# EAGLE design tda1072-ne612 (EAGLE 7.6.0)
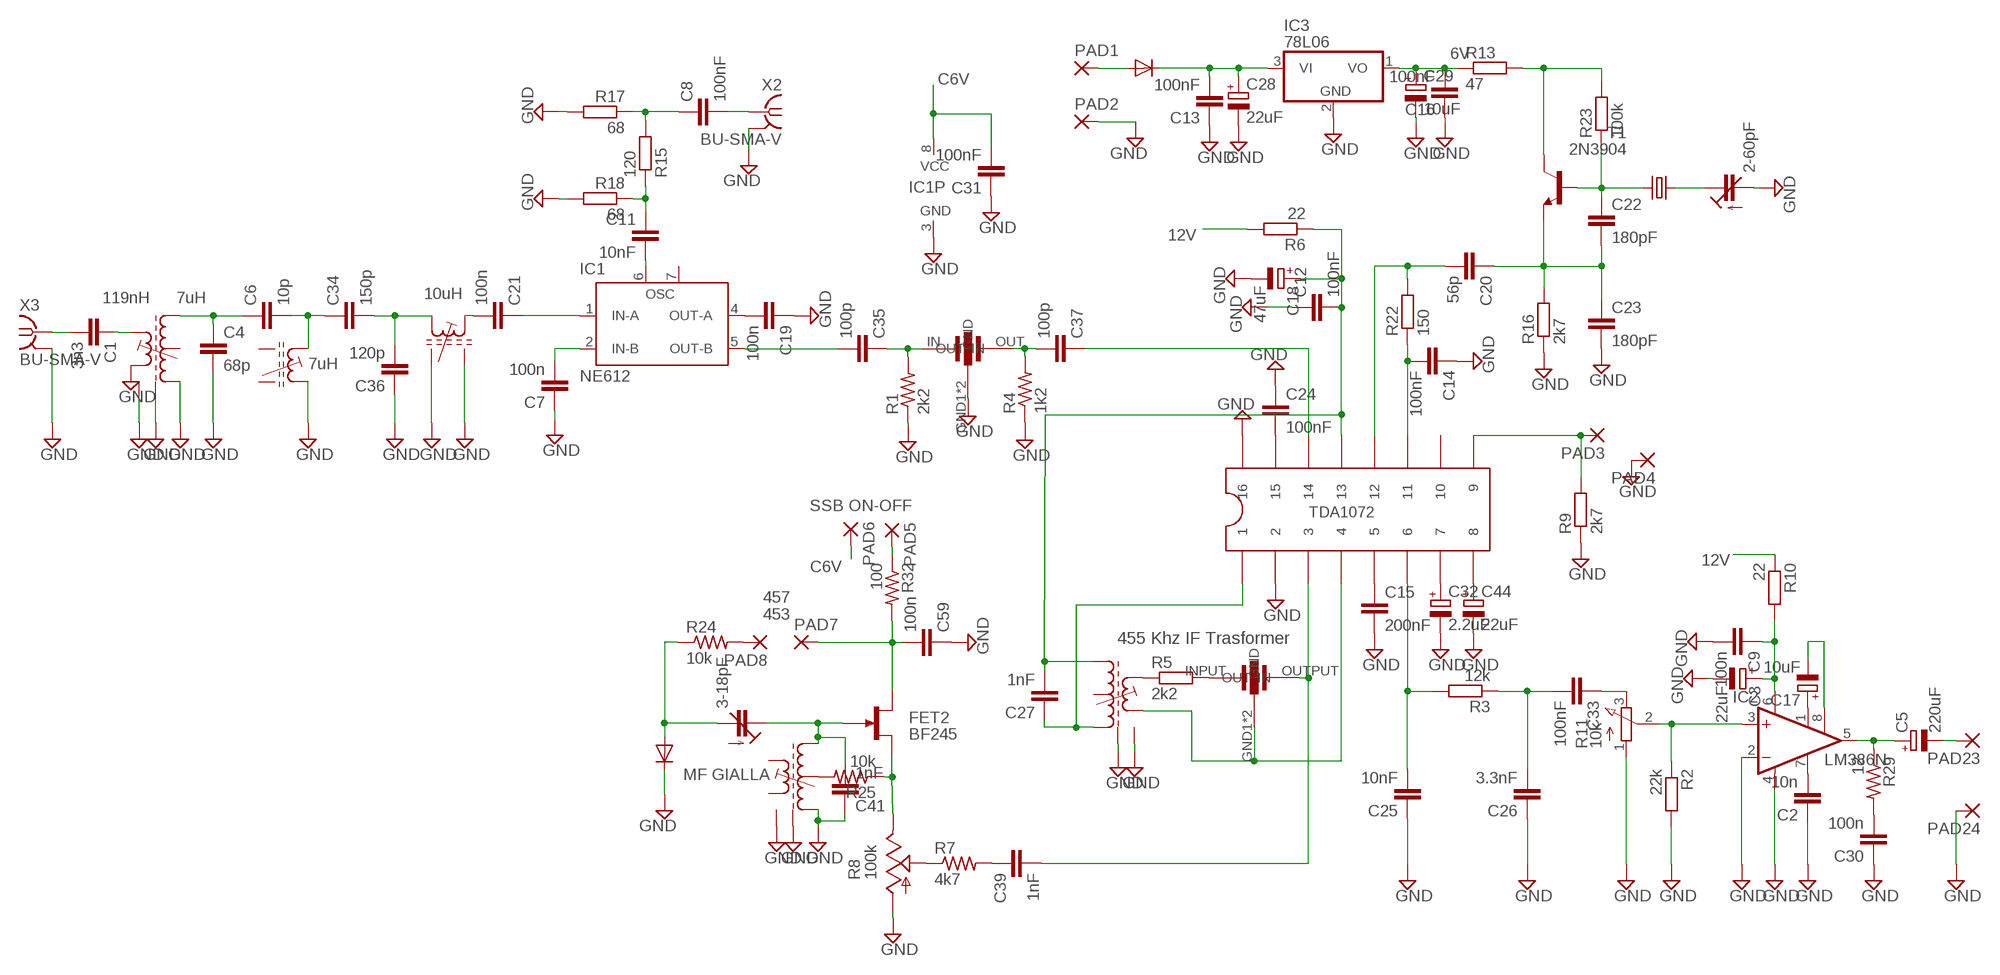
[diagram p0: schematic, sheet 1]

## Parts
10.245MHZ  10.245 Mhz  CRYSTALHC49S  [HC49/S]
C1  3n3  COND  [COND]
C2  10n  COND  [COND]
C3  22uF  CPOL-EUE1.8-4  [E1,8-4]
C4  68p  COND  [COND]
C5  220uF  CPOL-EUE3.5-8  [E3,5-8]
C6  10p  COND  [COND]
C7  100n  COND  [COND]
C8  100nF  COND  [COND]
C9  100n  COND  [COND]
C11  10nF  COND  [COND]
C12  100nF  COND  [COND]
C13  100nF  COND  [COND]
C14  100nF  COND  [COND]
C15  200nF  CER1  [CER1]
C16  100nF  COND  [COND]
C17  10uF  CPOL-EUE1.8-4  [E1,8-4]
C18  47uF  CPOL-EUE1.8-4  [E1,8-4]
C19  100n  COND  [COND]
C20  56p  COND  [COND]
C21  100n  COND  [COND]
C22  180pF  COND  [COND]
C23  180pF  COND  [COND]
C24  100nF  COND  [COND]
C25  10nF  COND  [COND]
C26  3.3nF  COND  [COND]
C27  1nF  COND  [COND]
C28  22uF  CPOL-EUE1.8-4  [E1,8-4]
C29  10uF  CPOL-EUE1.8-4  [E1,8-4]
C30  100n  COND_M  [COND_M]
C31  100nF  COND  [COND]
C32  2.2uF  CPOL-EUE1.8-4  [E1,8-4]
C33  100nF  COND  [COND]
C34  150p  COND  [COND]
C35  100p  COND  [COND]
C36  120p  COND  [COND]
C37  100p  COND  [COND]
C38  3-18pF  C-TRIMMTZ03  [CTRIMTZ03]
C39  1nF  COND  [COND]
C41  1nF  COND  [COND]
C44  22uF  CPOL-EUE1.8-4  [E1,8-4]
C55  2-60pF  C-TRIMMTZ03  [CTRIMTZ03]
C59  100n  COND  [COND]
D1  1N4004  [DO41-10]
D2  4148  1N4148DO35-7  [DO35-7]
FET2  BF245  [BF245]
IC1  NE612  SA612AN  [DIL08]
IC2  LM386N  LM386N-1  [DIL08]
IC3  78L06  78L05Z  [TO92]
MF1  MF-1  [MF-1]
MF2  MF-1  [MF-1]
MF3  MF-1  [MF-1]
MF4  MF-1  [MF-1]
MF5  MF-1  [MF-1]
PAD1  2,54/1,0  [2,54/1,0]
PAD2  2,54/1,0  [2,54/1,0]
PAD3  1,6/0,9  [1,6/0,9]
PAD4  1,6/0,9  [1,6/0,9]
PAD5  1,6/0,9  [1,6/0,9]
PAD6  1,6/0,9  [1,6/0,9]
PAD7  1,6/0,9  [1,6/0,9]
PAD8  1,6/0,9  [1,6/0,9]
PAD23  1,6/0,9  [1,6/0,9]
PAD24  1,6/0,9  [1,6/0,9]
R1  2k2  R-US_0204/7  [0204/7]
R2  22k  R-EU_0204/7  [0204/7]
R3  12k  R-EU_0204/7  [0204/7]
R4  1k2  R-US_0204/7  [0204/7]
R5  2k2  R-EU_0204/7  [0204/7]
R6  22  R-EU_0204/7  [0204/7]
R7  4k7  R-US_0204/7  [0204/7]
R8  100k  TRIM_US-LI10  [LI10]
R9  2k7  R-EU_0204/7  [0204/7]
R10  22  R-EU_0204/7  [0204/7]
R11  10k  3RP/1610N  [3RP/1610N]
R13  47  R-EU_0204/7  [0204/7]
R15  120  R-EU_0204/7  [0204/7]
R16  2k7  R-EU_0204/7  [0204/7]
R17  68  R-EU_0204/7  [0204/7]
R18  68  R-EU_0204/7  [0204/7]
R22  150  R-EU_0204/7  [0204/7]
R23  100k  R-EU_0204/7  [0204/7]
R24  10k  R-US_0204/7  [0204/7]
R25  10k  R-US_0204/7  [0204/7]
R29  12  R-US_0204/7  [0204/7]
R32  100  R-US_0204/7  [0204/7]
T1  2N3904  [TO92]
TDA1072  TDA1072  [TDA1072]
U$1  CFM455  [CFM455]
U$2  TOY  [TOY]
X2  BU-SMA-V  [BU-SMA-V]
X3  BU-SMA-V  [BU-SMA-V]

## Nets
6V: C16.2 C29.+ IC3.1(VO) R13.1
12V: C13.2 C28.+ D1.C IC3.3(VI) R6.2 R10.1
12V1: C3.+ C9.1 IC2.6(VS) R10.2
C6V: C31.2 IC1.8(VCC) PAD6.1(P) R13.2 R23.2 T1.1(C)
DD: C12.2 C18.+ C27.2 MF4.P$1(A1) R6.1 TDA1072.13
GND: C2.1 C3.- C4.2 C7.1 C9.2 C12.1 C13.1 C14.1 C15.2 C16.1 C18.- C19.1 C23.2 C24.1 C25.1 C26.1 C28.- C29.- C30.1 C31.1 C32.- C36.1 C41.1 C44.- C55.2(A) C59.1 D2.C IC1.3(GND) IC2.2(-IN) IC2.4(GND) IC3.2(GND) MF1.GND1 MF1.GND2 MF1.S1(GND2) MF1.S2(GND2) MF1.S3(GND2) MF2.P$3(E1) MF2.P$5(E2) MF2.P$6 MF2.P$7 MF3.A2 MF4.P$6 MF4.P$7 MF5.P$3(E1) MF5.P$6 MF5.P$7 PAD2.1(P) PAD4.1(P) PAD24.1(P) R1.1 R2.2 R4.1 R8.A R9.1 R11.1(A) R16.1 R17.2 R18.2 TDA1072.2 TDA1072.16 U$2.GND1(GND) U$2.GND2(GND) X2.2 X2.3 X2.4 X2.5 X3.2 X3.3 X3.4 X3.5
N$1: C21.1 IC1.1(IN-A)
N$7: C1.1 MF2.P$4(A2)
N$8: C4.1 C6.1 MF2.P$1(A1)
N$9: C1.2 X3.1
N$10: C6.2 C34.1 MF3.A1
N$11: C37.1 TDA1072.14
N$12: C34.2 C36.2 MF1.A2
N$13: C21.2 MF1.A1
N$14: C7.2 IC1.2(IN-B)
N$15: C11.2 IC1.6(OSC)
N$17: C33.1 R11.3(E)
N$19: C39.2 TDA1072.3 U$1.OUTPUT(OUT)
N$20: R5.2 U$1.INPUT(IN)
N$21: C35.2 IC1.5(OUT-B)
N$23: D1.A PAD1.1(P)
N$24: C8.2 X2.1
N$25: C19.2 IC1.4(OUT-A)
N$26: MF4.P$5(E2) TDA1072.4 U$1.GND1(GND) U$1.GND2(GND)
N$27: C15.1 TDA1072.5
N$28: C32.+ TDA1072.7
N$29: C44.+ TDA1072.8
N$30: C20.2 R22.2 TDA1072.12
N$31: C8.1 R15.2 R17.1
N$32: C20.1 C22.2 C23.1 R16.2 T1.3(E)
N$33: C14.2 R22.1 TDA1072.11
N$34: 10.245MHZ.1 C22.1 R23.1 T1.2(B)
N$35: C35.1 R1.2 U$2.IN
N$36: PAD8.1(P) R24.2
N$37: C37.2 R4.2 U$2.OUT
N$39: C24.2 TDA1072.15
N$40: C25.2 R3.2 TDA1072.6
N$41: C26.2 C33.2 R3.1
N$42: 10.245MHZ.2 C55.1(E)
N$43: C17.+ IC2.1(GAIN)
N$44: C11.1 R15.1 R18.1
N$47: MF5.P$2(Z) R25.2
N$48: R7.1 R8.S
N$57: C30.2 R29.2
N$60: C5.- PAD23.1(P)
N$62: C5.+ IC2.5(OUT) R29.1
N$64: IC2.3(+IN) R2.1 R11.2(S)
N$65: C2.2 IC2.7(BYPASS)
N$67: C17.- IC2.8(GAIN)
N$70: C38.1(E) C41.2 FET2.G MF5.P$1(A1)
N$71: FET2.S R8.E R25.1
N$72: C38.2(A) D2.A R24.1
N$75: C39.1 R7.2
N$76: MF4.P$4(A2) R5.1
N$78: C59.2 FET2.D PAD7.1(P) R32.2
N$93: C27.1 MF4.P$3(E1) TDA1072.1
S-METER: PAD3.1(P) R9.2 TDA1072.9
SSB: PAD5.1(P) R32.1
Unconnected: IC1.7(OSC') MF2.P$2(Z) MF3.GND1 MF3.GND2 MF3.S1(GND2) MF3.S2(GND2) MF3.S3(GND2) MF4.P$2(Z) MF5.P$4(A2) MF5.P$5(E2) TDA1072.10

## Notes on the sheet
- 119nH | 7uH | 10uH
- 7uH
- SSB ON-OFF
- 457
  453
- 455 Khz IF Trasformer
- MF GIALLA

## Library data of the parts
10.245MHZ = crystal:CRYSTAL: CRYSTAL; OC_FARNELL: 1667008; OC_NEWARK: unknown
C1 C2 C4 C6-C9 C11-C14 C16 C19-C27 C31 C33-C37 C39 C41 C59 = 11cond:COND
C3 C5 C17 C18 C28 C29 C32 C44 = resistor:CPOL-EU: POLARIZED CAPACITOR, European symbol
C15 = 13cond:CER1
C30 = 12cond:COND_M
C38 C55 = rcl:C-TRIMM: Trimm capacitor
D1 = diode:1N4004: DIODE general purpose rectifier, 1 A
D2 = diode:1N4148: DIODE high speed (Philips)
FET2 = bf245:BF245
IC1 = linear:SA612A: Double-balanced mixer and oscillator NE612/SA612 Source: www-eu2.semiconductors.philips.com/acrobat/datasheets/SA612A.pdf
IC2 = linear:LM386?-*: Low Voltage Audio Power Amplifier Source: http://cache.national.com/ds/LM/LM386.pdf
IC3 = linear:78*: Positive VOLTAGE REGULATOR Source: http://cache.national.com/ds/LM/LM78L05.pdf http://www.fairchildsemi.com/ds/LM/LM7805.pdf
MF1 MF3 = MF-4:MF-1
MF2 MF4 MF5 = MF-1:MF-1
PAD1 PAD2 = wirepad:2,54/1,0: THROUGH-HOLE PAD
PAD3-PAD8 PAD23 PAD24 = wirepad:1,6/0,9: THROUGH-HOLE PAD
R1 R4 R7 R24 R25 R29 R32 = rcl:R-US_: RESISTOR, American symbol
R2 R3 R5 R6 R9 R10 R13 R15-R18 R22 R23 = rcl:R-EU_: RESISTOR, European symbol
R8 = pot:TRIM_US-: POTENTIOMETER
R11 = pot:3RP/1610N: 16mm Potentiometer one level Source: http://www.alphapotentiometers.net/html/16mm_pot_2.html
T1 = transistor-neu-to92:2N3904: NPN TRANSISTOR
TDA1072 = tda1072:TDA1072
U$1 = cfm455:CFM455
U$2 = toy:TOY
X2 X3 = con-coax:BU-SMA-V: FEMALE SMA CONNECTOR Radiall distributor RS 112-3794; OC_FARNELL: unknown; OC_NEWARK: unknown

## Board
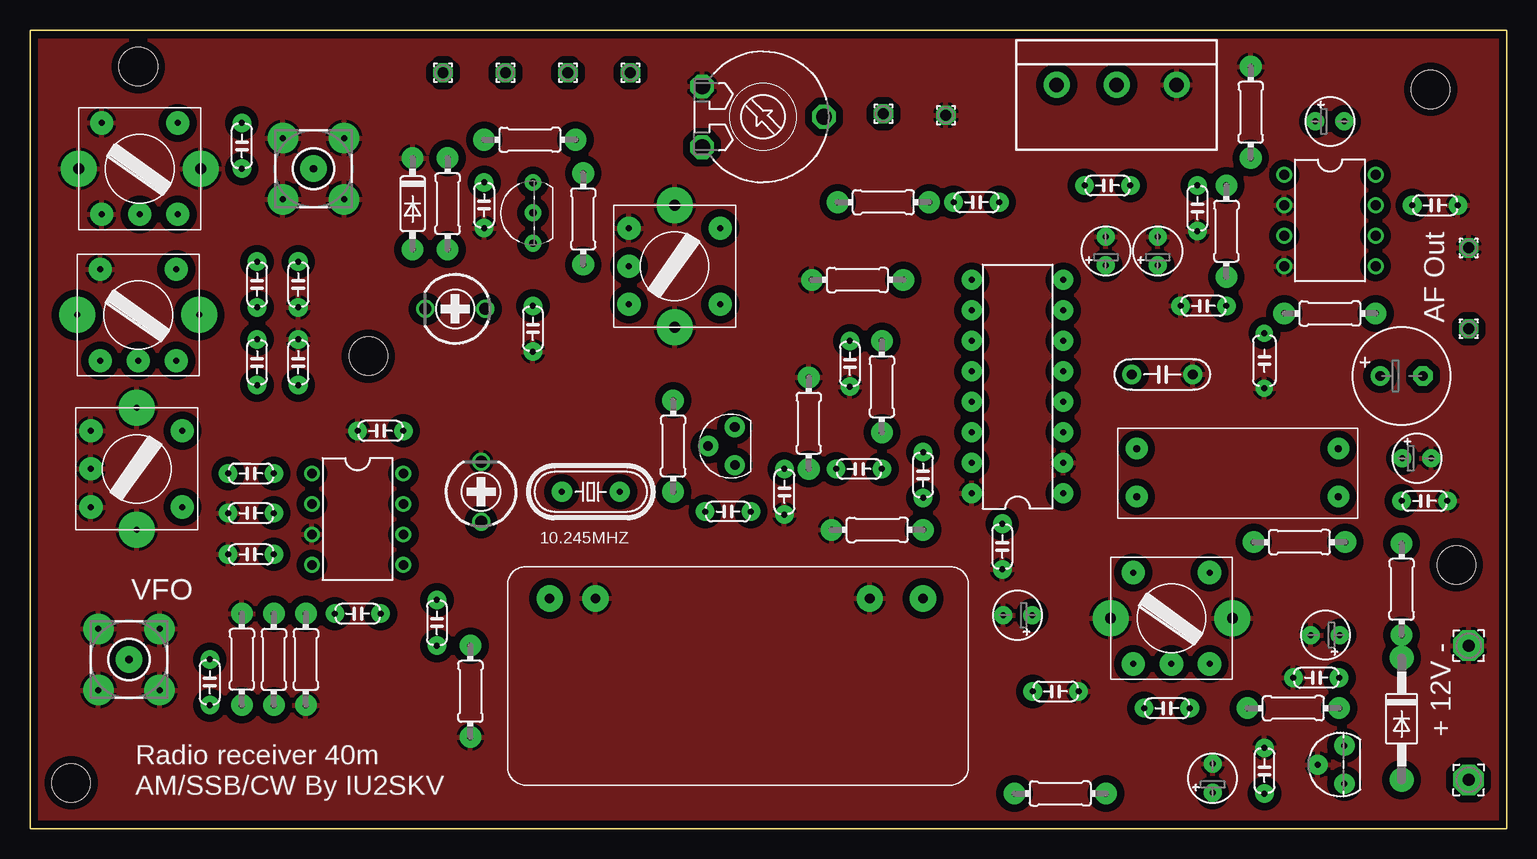
[diagram p1: board, top side]
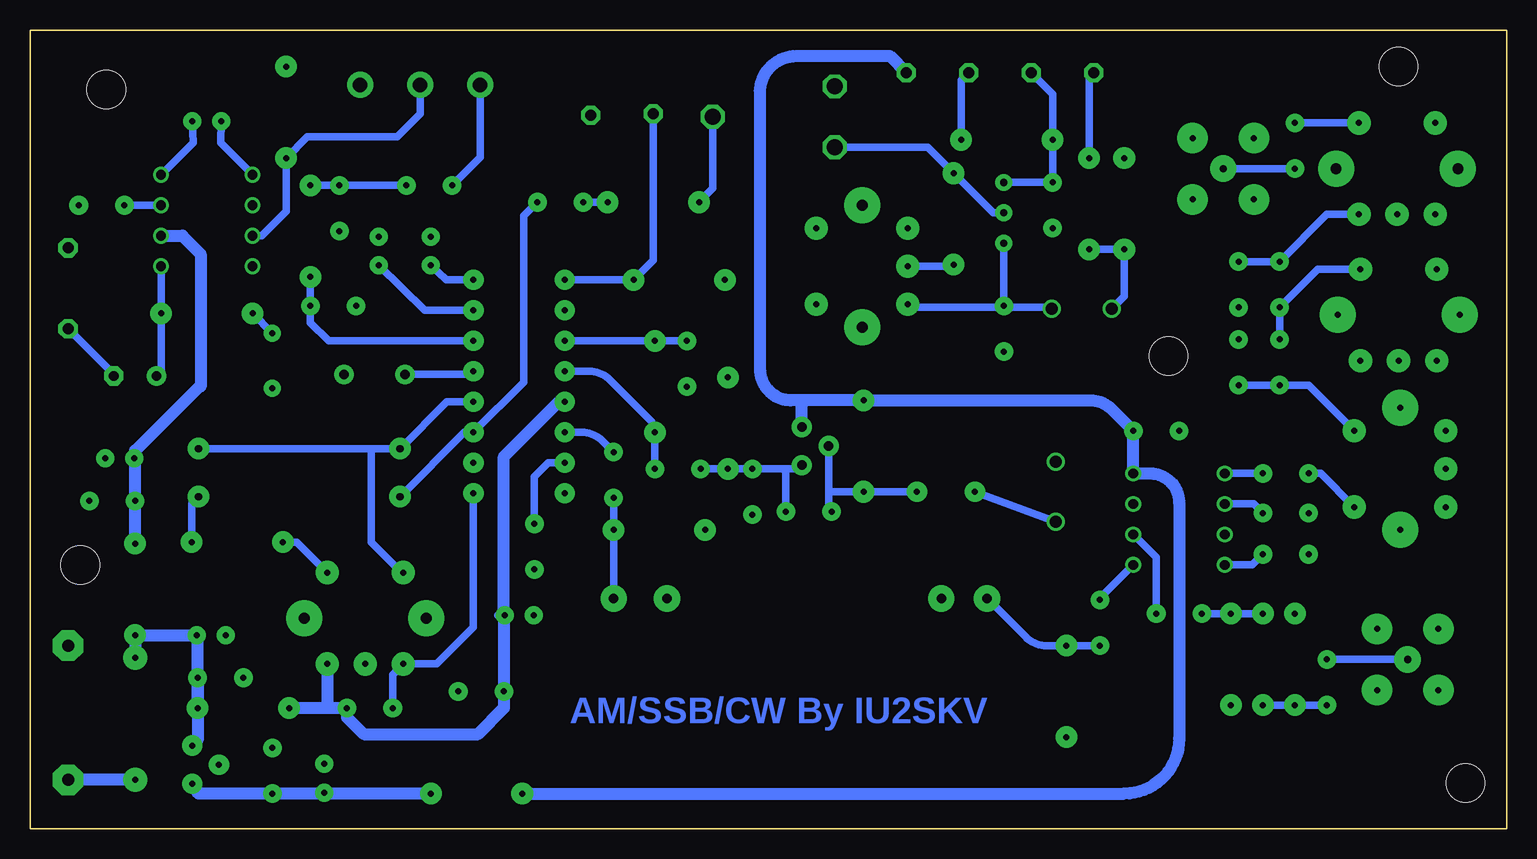
[diagram p2: board, bottom side, seen from below]

Size 123.06 x 66.55 mm. Coordinates in mm from the lower left corner, seen from the top.
Outline: 0,66.55 123.06,66.55 123.06,0 0,0 0,66.55
Copper layers (1*16): Top 0.035mm / dielectric 1.5mm / Bottom 0.035mm
Design rules "default *": minimum track width 10mil, minimum drill 24mil, track to track 8mil, track to pad 8mil, pad to pad 8mil, via to via 8mil, smd to smd 8mil, copper to edge 1mil, drill to drill 8mil, minimum pad ring 10mil, minimum via ring 8mil, stop-mask expansion 4mil, vias tented up to drill 0mil, thermal gap 10mil
Holes 3.2 mm at 3.43,3.81 9.02,63.5 116.71,61.59 118.87,21.97 28.19,39.37

### Footprints (pad centres in the part's own frame; a part is rotated, then mirrored left to right if it is on the bottom)
HC49/S = drill 0.5 pad 1.7: 1 -2.413,0; 2 2.413,0
COND = drill 0.5 pad 1.55: 1 -1.905,0; 2 1.905,0
E1,8-4 = drill 0.5 pad 1.5: + -1.206,0; - 1.206,0
E3,5-8 = drill 0.813 pad 1.6: + -1.778,0 | drill 0.813 pad 1.6 octagon: - 1.778,0
CER1 = drill 0.813 pad 1.6: 1 -2.54,0; 2 2.54,0
COND_M = drill 0.5 pad 1.422: 1 -2.286,0; 2 2.286,0
CTRIMTZ03 = drill 1: 1 0,2.5; 2 0,-2.5
DO41-10 = drill 0.5 pad 2: A 5.08,0; C -5.08,0
DO35-7 = drill 0.5 pad 1.8: A 3.81,0; C -3.81,0
BF245 = drill 0.6 pad 1.4: D 2.54,0; G -2.54,0; S 0,0
DIL08 = drill 0.813 pad 1.27: 1 -3.81,-3.81; 2 -1.27,-3.81; 3 1.27,-3.81; 4 3.81,-3.81; 5 3.81,3.81; 6 1.27,3.81; 7 -1.27,3.81; 8 -3.81,3.81
TO92 = drill 0.5 pad 1.676: 1 -1.587,-0.318; 2 0,1.905; 3 1.587,-0.318
MF-1 = drill 0.5 pad 1.93: A1 -3.175,-3.81; A2 3.175,-3.81; S1 -3.175,3.81; S2 0,3.81; S3 3.175,3.81 | drill 0.5 pad 3: GND1 -5.08,0; GND2 5.08,0
MF-1' = drill 0.5 pad 1.93: P$1 -3.175,3.81; P$2 0,3.81; P$3 3.175,3.81; P$4 -3.175,-3.81; P$5 3.175,-3.81 | drill 0.9 pad 3: P$6 5.08,0; P$7 -5.08,0
2,54/1,0 = drill 1.016 pad 2.54 octagon: 1 0,0
1,6/0,9 = drill 0.914 pad 1.6 octagon: 1 0,0
0204/7 = drill 0.5 pad 1.8: 1 -3.81,0; 2 3.81,0
LI10 = drill 1.321 octagon: A -2.54,-5.08; E 2.54,-5.08; S 0,5.08
3RP/1610N = drill 1.2 pad 2.184: 1 -5,0; 2 0,0; 3 5,0
TO92' = drill 0.813 pad 1.676: 1 1.587,-0.318 | drill 0.8 pad 1.676: 2 0,1.905; 3 -1.587,-0.318
TDA1072 = drill 0.5 pad 1.676: 1 -8.89,-3.81; 2 -6.35,-3.81; 3 -3.81,-3.81; 4 -1.27,-3.81; 5 1.27,-3.81; 6 3.81,-3.81; 7 6.35,-3.81; 8 8.89,-3.81; 9 8.89,3.81; 10 6.35,3.81; 11 3.81,3.81; 12 1.27,3.81; 13 -1.27,3.81; 14 -3.81,3.81; 15 -6.35,3.81; 16 -8.89,3.81
CFM455 = drill 0.6 pad 1.8: GND1 -12,-5.5; GND2 4.8,-5.5; INPUT -12,-1.5; OUTPUT 4.8,-1.5
TOY = drill 0.8 pad 2.184: GND1 -11.43,4.445; GND2 11.43,4.445; IN -15.24,4.445; OUT 15.875,4.445
BU-SMA-V = drill 0.6 pad 2.2: 1 0,0 | drill 0.5 pad 2.54: 2 -2.55,2.55; 3 2.55,2.55; 4 2.55,-2.55; 5 -2.55,-2.55

### Placement (x,y rotation side)
10.245MHZ  46.74,28.07 180 top
C1  17.65,56.9 270 top
C2  117.09,51.94 180 top
C3  115.57,30.86 0 top
C4  22.35,45.34 270 top
C5  114.3,37.72 0 top
C6  18.92,45.34 270 top
C7  18.42,26.29 0 top
C8  14.99,12.19 90 top
C9  116.21,27.3 0 top
C11  27.31,17.91 0 top
C12  85.47,11.43 180 top
C13  107.19,12.57 0 top
C14  68.33,38.73 90 top
C15  94.36,37.85 0 top
C16  102.87,4.83 270 top
C17  108.33,58.93 0 top
C18  82.3,17.78 180 top
C19  18.42,22.86 0 top
C20  69.09,29.97 0 top
C21  18.42,29.59 180 top
C22  58.17,26.42 0 top
C23  62.87,28.07 270 top
C24  81.03,23.49 90 top
C25  97.79,43.56 0 top
C26  97.28,51.69 90 top
C27  94.74,10.03 0 top
C28  107.95,16.13 180 top
C29  98.55,4.19 90 top
C30  102.87,38.99 90 top
C31  29.21,33.15 0 top
C32  93.98,48.13 90 top
C33  89.79,53.59 0 top
C34  18.92,38.86 270 top
C35  33.91,17.14 90 top
C36  22.35,38.86 270 top
C37  74.42,29.46 270 top
C38  35.43,43.31 270 top
C39  78.87,52.2 0 top
C41  41.91,41.66 90 top
C44  89.66,48.13 90 top
C55  37.59,28.07 180 top
C59  37.85,51.94 90 top
D1  114.3,9.14 270 top
D2  31.88,52.07 270 top
FET2  41.91,51.31 90 top
IC1  27.31,25.78 270 top
IC2  108.33,50.67 270 top
IC3  109.22,5.33 90 top
MF1  8.89,29.97 90 top
MF2  MF-1  [MF-1']  9.14,54.99 180 top
MF3  9.02,42.8 180 top
MF4  MF-1  [MF-1']  95.12,17.53 180 top
MF5  MF-1  [MF-1']  53.72,46.86 90 top
PAD1  119.89,4.06 0 top
PAD2  119.89,15.24 0 top
PAD3  71.12,59.56 0 top
PAD4  76.33,59.44 0 top
PAD5  44.83,62.99 0 top
PAD6  50.04,62.99 0 top
PAD7  39.62,62.99 0 top
PAD8  34.42,62.99 0 top
PAD23  119.89,41.66 90 top
PAD24  119.89,48.39 90 top
R1  36.7,11.43 90 top
R2  101.73,59.69 90 top
R3  99.7,49.78 270 top
R4  70.61,24.89 0 top
R5  105.79,23.88 0 top
R6  105.28,10.03 0 top
R7  71.12,52.2 0 top
R8  61.09,59.31 270 top
R9  68.96,45.72 0 top
R10  114.3,19.94 90 top
R11  90.55,61.98 180 top
R13  85.85,2.92 180 top
R15  20.32,14.1 270 top
R16  64.9,33.78 270 top
R17  17.65,14.1 90 top
R18  22.99,14.1 270 top
R22  70.99,36.83 270 top
R23  53.59,31.88 90 top
R24  34.8,52.07 90 top
R25  46.1,50.8 270 top
R29  108.33,42.93 180 top
R32  41.66,57.4 180 top
T1  2N3904  [TO92']  58.42,31.88 90 top
TDA1072  82.3,36.83 90 top
U$1  97.03,26.16 180 top
U$2  58.55,14.73 0 top
X2  8.26,14.1 0 top
X3  23.62,54.99 0 top

### Tracks (layer width: path | path; a pad name or v marks a point on that pad's centre or on a via)
6V
  Bottom 1.016: IC3.1 109.03,2.92 C16.2 98.81,2.92 | R13.1 98.81,2.92 | C29.+ 98.74,2.98 98.81,2.92
12V
  Bottom 1.016: D1.C R10.1 C28.+ 109.09,16.06 C13.2 | R6.2 C13.2 | C13.2 109.09,7.37 IC3.3
12V1
  Bottom 1.016: IC2.6 110.36,49.4 108.84,47.88 108.84,36.96 | 108.84,36.96 108.84,36.83 | R10.2 C9.1 114.3,30.73 | 114.3,30.73 114.3,31.5 108.84,36.96 | C3.+ 114.24,30.8 114.3,30.73
C6V
  Bottom 1.016: PAD6.1 51.44,64.39 59.18,64.39 arc-90 62.23,61.34 62.23,38.25 arc-45 61.5,36.48 61.44,36.42 arc-45 59.67,35.69 58.42,35.69 | R13.2 31.88,2.92 arc-90 27.31,7.49 27.31,27.18 arc-90 29.72,29.59 IC1.8 C31.2 32.92,34.95 arc-45 34.69,35.69 R23.2 58.42,35.69 | 58.67,33.46 T1.1 58.74,35.37 58.42,35.69
DD
  Bottom 0.61: 98.3,10.16 98.43,10.03 | C18.+ 84.07,17.78 83.57,18.29 | C27.2 96.65,9.27 | C12.2 83.57,11.81
  Bottom 1.016: C27.2 98.43,10.03 R6.1 | MF4.P$1 98.3,10.16 | 96.65,9.27 95.25,7.87 85.73,7.87 83.57,10.03 83.57,11.81 83.57,18.29 83.57,30.99 78.99,35.56 TDA1072.13
GND
  pour Top (isolate 0.61): 0,66.55 123.06,66.55 123.06,0 0,0
N$1
  Bottom 0.61: C21.1 IC1.1
N$7
  Bottom 0.61: MF2.P$4 C1.1
N$8
  Bottom 0.61: MF2.P$1 14.99,51.18 C6.1 C4.1
N$9
  Bottom 0.61: X3.1 C1.2
N$10
  Bottom 0.61: C34.1 C6.2 15.75,46.61 MF3.A1
N$11
  Bottom 0.61: TDA1072.14 77.11,33.02 arc45 75.34,32.29 C37.1
N$12
  Bottom 0.61: MF1.A2 16.51,36.96 C34.2 C36.2
N$13
  Bottom 0.61: C21.2 15.49,29.59 MF1.A1
N$14
  Bottom 0.61: IC1.2 21.08,27.05 C7.2
N$15
  Bottom 0.61: C11.2 29.21,22.61 IC1.6
N$17
  Bottom 0.61: R11.3 85.55,55.93 C33.1
N$19
  Bottom 0.61: C39.2 81.92,51.05 81.92,37.21 TDA1072.3 86.87,33.02 U$1.OUTPUT
N$20
  Bottom 0.61: R5.2 109.6,27.09 U$1.INPUT
N$21
  Bottom 0.61: C35.2 33.91,19.18 IC1.5
N$23
  Bottom 1.016: D1.A PAD1.1
N$24
  Bottom 0.61: X2.1 C8.2
N$25
  Bottom 0.61: IC1.4 21.21,21.97 C19.2
N$26
  Bottom 0.61: TDA1072.4 88.33,35.56 U$1.GND2 94.62,31.66 | 94.62,31.66 U$1.GND1 | 94.62,31.66 94.62,23.88 92.08,21.34 MF4.P$5
N$27
  Bottom 0.61: C15.1 86.36,37.85 TDA1072.5
N$28
  Bottom 0.61: TDA1072.7 90.17,43.18 C32.+
N$29
  Bottom 0.61: TDA1072.8 88.39,45.72 C44.+
N$30
  Bottom 0.61: C20.2 R22.2 arc-45 71.44,34.1 74.71,37.37 arc-45 76.47,38.1 TDA1072.12
N$31
  Bottom 0.61: R15.2 18.29,10.29 18.16,10.16 17.78,10.16 R17.1 C8.1
N$32
  Bottom 0.61: 60.45,29.97 C23.1 R16.2 C20.1 | C22.2 60.07,29.84 60.45,29.97 | 60.45,29.97 59.06,29.97 T1.3
N$33
  Bottom 0.61: TDA1072.11 R22.1 C14.2
N$34
  Bottom 0.61: 10.245MHZ.1 R23.1 56.21,28.07 arc-45 56.52,27.94 | T1.2 56.52,27.94 | 56.52,27.94 56.52,27.03 arc-45 C22.1
N$35
  Bottom 0.61: C35.1 R1.2 38.33,15.24 arc45 40.1,15.97 U$2.IN
N$36
  Bottom 0.61: R24.2 34.8,62.61 PAD8.1
N$37
  Bottom 0.61: U$2.OUT R4.2 C37.2
N$39
  Bottom 0.61: C24.2 81.03,29.34 79.88,30.48 TDA1072.15
N$40
  Bottom 0.61: R3.2 C25.2 99.7,42.16 98.17,40.64 TDA1072.6
N$41
  Bottom 0.61: C33.2 C26.2 R3.1
N$42
  Bottom 0.61: C55.1 44.11,27.98 arc45 10.245MHZ.2
N$43
  Bottom 0.61: C17.+ 107.19,57.15 IC2.1
N$44
  Bottom 0.61: R15.1 R18.1 C11.1
N$47
  Bottom 0.61: MF5.P$2 46.23,46.86 R25.2
N$48
  Bottom 0.61: R8.S 66.17,53.34 R7.1
N$57
  Bottom 0.61: C30.2 R29.2
N$60
  Bottom 0.61: C5.- 116.08,37.85 PAD23.1
N$62
  Bottom 0.61: IC2.5 R29.1 112.14,38.1 C5.+
N$64
  Bottom 0.61: IC2.3 103.76,49.4 101.73,51.43 R2.1 99.95,57.66 92.46,57.66 90.55,59.56 R11.2
N$65
  Bottom 0.61: IC2.7 C2.2
N$67
  Bottom 0.61: C17.- 109.47,57.15 IC2.8
N$70
  Bottom 0.61: 41.78,43.81 C41.2 FET2.G | C38.1 38.06,43.43 41.91,43.43 | 41.91,43.69 41.78,43.81 | 41.91,43.43 49.66,43.43 MF5.P$1 | 41.78,43.81 41.78,43.56 41.91,43.43
N$71
  Bottom 0.61: FET2.S 42.8,51.31 R25.1 48.26,56.77 R8.E
N$72
  Bottom 0.61: C38.2 31.88,44.36 D2.A R24.1
N$75
  Bottom 0.61: R7.2 C39.1
N$76
  Bottom 0.61: R5.1 100.84,23.88 MF4.P$4
N$78
  Bottom 0.61: FET2.D C59.2 R32.2 37.85,61.21 PAD7.1
N$93
  Bottom 0.61: TDA1072.1 86.11,16.76 89.15,13.72 MF4.P$3 92.84,12.83 C27.1
S-METER
  Bottom 0.61: PAD3.1 71.12,47.37 R9.2 TDA1072.9
SSB
  Bottom 0.61: R32.1 45.47,62.36 PAD5.1

### Text on the board
Bottom: AM/SSB/CW By IU2SKV
tPlace: AF Out | VFO | + 12V - | Radio receiver 40m | AM/SSB/CW By IU2SKV